# EAGLE schematic sch1 - Copy (EAGLE 8.4.3)
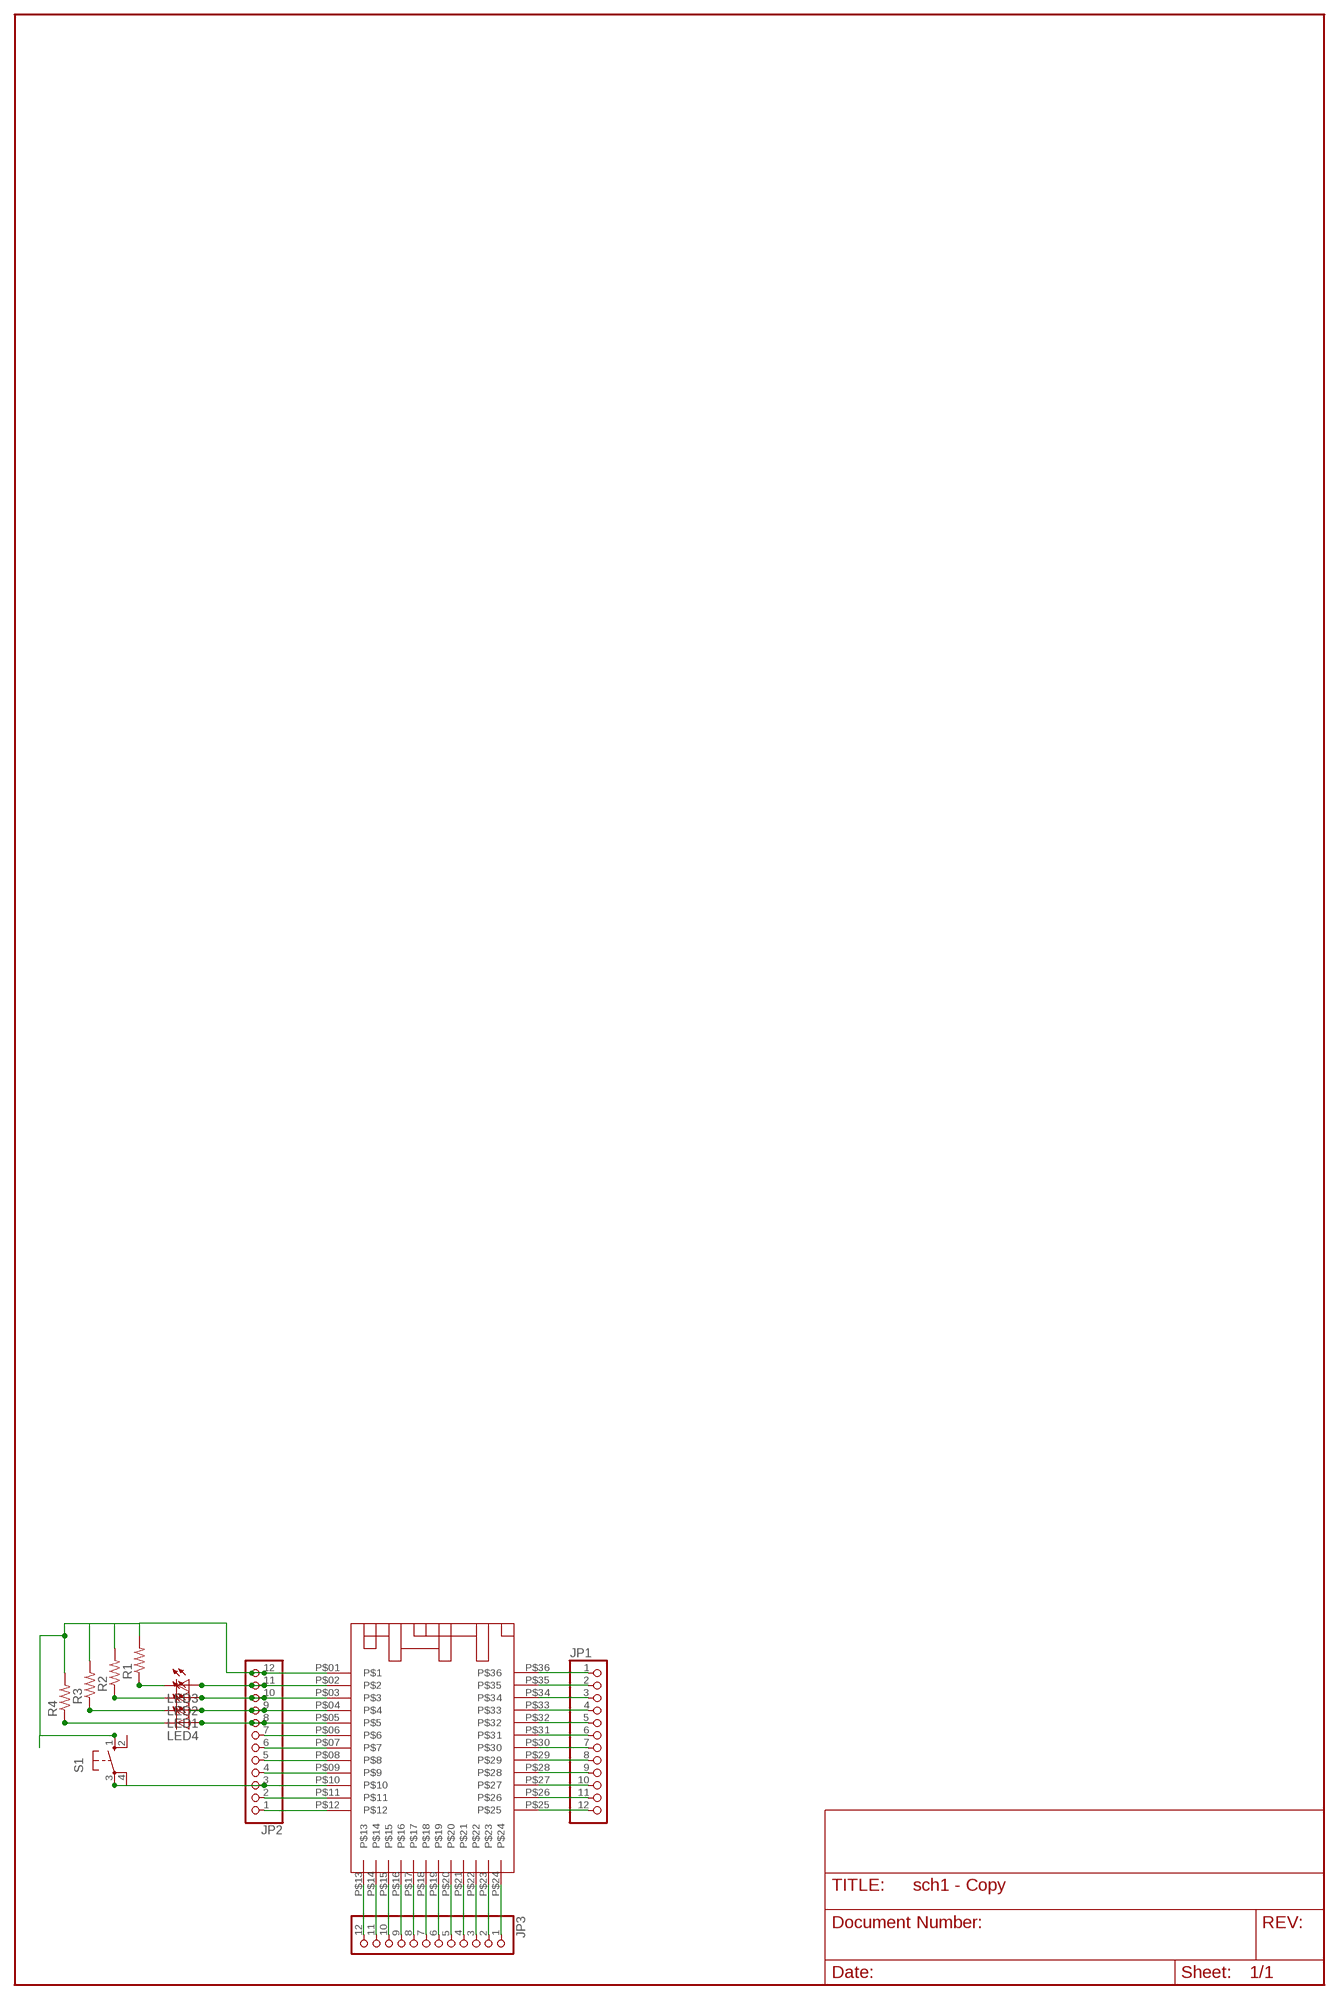
[diagram p0: schematic, sheet 1]

## Parts
JP1  PINHD-1X12  [1X12]
JP2  PINHD-1X12  [1X12]
JP3  PINHD-1X12  [1X12]
LED1  LED3MM  [LED3MM]
LED2  LED3MM  [LED3MM]
LED3  LED3MM  [LED3MM]
LED4  LED3MM  [LED3MM]
R1  R-US_0204/5  [0204/5]
R2  R-US_0204/5  [0204/5]
R3  R-US_0204/5  [0204/5]
R4  R-US_0204/5  [0204/5]
S1  10-XX  [B3F-10XX]
U$1  HZX_MODULE  [SMD_PAD_VERSION]

## Nets
N$1: JP1.1 U$1.P$36
N$2: JP1.2 U$1.P$35
N$3: JP1.3 U$1.P$34
N$4: JP1.4 U$1.P$33
N$5: JP1.5 U$1.P$32
N$6: JP1.6 U$1.P$31
N$7: JP1.7 U$1.P$30
N$8: JP1.8 U$1.P$29
N$9: JP1.9 U$1.P$28
N$10: JP1.10 U$1.P$27
N$11: JP1.11 U$1.P$26
N$12: JP1.12 U$1.P$25
N$13: JP2.1 U$1.P$12
N$14: JP2.2 U$1.P$11
N$15: JP2.3 S1.3(P) U$1.P$10
N$16: JP2.4 U$1.P$09
N$17: JP2.5 U$1.P$08
N$18: JP2.6 U$1.P$07
N$19: JP2.7 U$1.P$06
N$20: JP2.8 LED4.A U$1.P$05
N$21: JP2.9 LED1.A U$1.P$04
N$22: JP2.10 LED2.A U$1.P$03
N$23: JP2.11 LED3.A U$1.P$02
N$24: JP2.12 R1.2 R2.2 R3.2 R4.2 S1.1(S) U$1.P$01
N$25: JP3.1 U$1.P$24
N$26: JP3.2 U$1.P$23
N$27: JP3.3 U$1.P$22
N$28: JP3.4 U$1.P$21
N$29: JP3.5 U$1.P$20
N$30: JP3.6 U$1.P$19
N$31: JP3.7 U$1.P$18
N$32: JP3.8 U$1.P$17
N$33: JP3.9 U$1.P$16
N$34: JP3.10 U$1.P$15
N$35: JP3.11 U$1.P$14
N$36: JP3.12 U$1.P$13
N$38: LED4.K(C) R4.1
N$39: LED1.K(C) R3.1
N$40: LED2.K(C) R2.1
N$41: LED3.K(C) R1.1
Unconnected: S1.2(S1) S1.4(P1)

## Library data of the parts
JP1-JP3 = pinhead:PINHD-1X12: PIN HEADER
LED1-LED4 = led:LED: LED OSRAM: - CHIPLED LG R971, LG N971, LY N971, LG Q971, LY Q971, LO R971, LY R971 LH N974, LH R974 LS Q976, LO Q976, LY Q976 LO Q996 - Hyper CHIPLED LW Q18S LB Q993, LB Q99A, LB R99A - SideLED LS A670, LO A670, LY A670, LG A670, LP A670 LB A673, LV A673, LT A673, LW A673 LH A674 LY A675 LS A676, LA A676, LO A676, LY A676, LW A676 LS A679, LY A679, LG A679 - Hyper Micro SIDELED® LS Y876, LA Y876, LO Y876, LY Y876 LT Y87S - SmartLED LW L88C, LW L88S LB L89C, LB L89S, LG L890 LS L89K, LO L89K, LY L89K LS L896, LA L896, LO L896, LY L896 - TOPLED LS T670, LO T670, LY T670, LG T670, LP T670 LSG T670, LSP T670, LSY T670, LOP T670, LYG T670 LG T671, LOG T671, LSG T671 LB T673, LV T673, LT T673, LW T673 LH T674 LS T676, LA T676, LO T676, LY T676, LB T676, LH T676, LSB T676, LW T676 LB T67C, LV T67C, LT T67C, LS T67K, LO T67K, LY T67K, LW E67C LS E67B, LA E67B, LO E67B, LY E67B, LB E67C, LV E67C, LT E67C LW T67C LS T679, LY T679, LG T679 LS T770, LO T770, LY T770, LG T770, LP T770 LB T773, LV T773, LT T773, LW T773 LH T774 LS E675, LA E675, LY E675, LS T675 LS T776, LA T776, LO T776, LY T776, LB T776 LHGB T686 LT T68C, LB T68C - Hyper Mini TOPLED® LB M676 - Mini TOPLED Santana® LG M470 LS M47K, LO M47K, LY M47K Source: http://www.osram.convergy.de LUXEON: - LUMILED® LXK2-PW12-R00, LXK2-PW12-S00, LXK2-PW14-U00, LXK2-PW14-V00 LXK2-PM12-R00, LXK2-PM12-S00, LXK2-PM14-U00 LXK2-PE12-Q00, LXK2-PE12-R00, LXK2-PE12-S00, LXK2-PE14-T00, LXK2-PE14-U00 LXK2-PB12-K00, LXK2-PB12-L00, LXK2-PB12-M00, LXK2-PB14-N00, LXK2-PB14-P00, LXK2-PB14-Q00 LXK2-PR12-L00, LXK2-PR12-M00, LXK2-PR14-Q00, LXK2-PR14-R00 LXK2-PD12-Q00, LXK2-PD12-R00, LXK2-PD12-S00 LXK2-PH12-R00, LXK2-PH12-S00 LXK2-PL12-P00, LXK2-PL12-Q00, LXK2-PL12-R00 Source: www.luxeon.com KINGBRIGHT: KA-3528ASYC Source: www.kingbright.com
R1-R4 = resistor:R-US_: RESISTOR, American symbol
S1 = switch-omron:10-XX: OMRON SWITCH; MPN: B3F-1000; OC_FARNELL: 176432; OC_NEWARK: 36M3542
U$1 = HZX_MODULE:HZX_MODULE; AUTHOR: Agam